# Altium schematic sheet Linelance_Schematic_page3.SchDoc
size A2; Author: Dubatouka U.V.; Address1: Address1; Address2: Address2; Address3: Address3; Address4: Address4; DocumentNumber: 3; SheetNumber: 3; SheetTotal: 3; Scale: 1:1; DocumentType: Схема электрическая принципиальная; FirstReferrence: АБВГ.123456.001
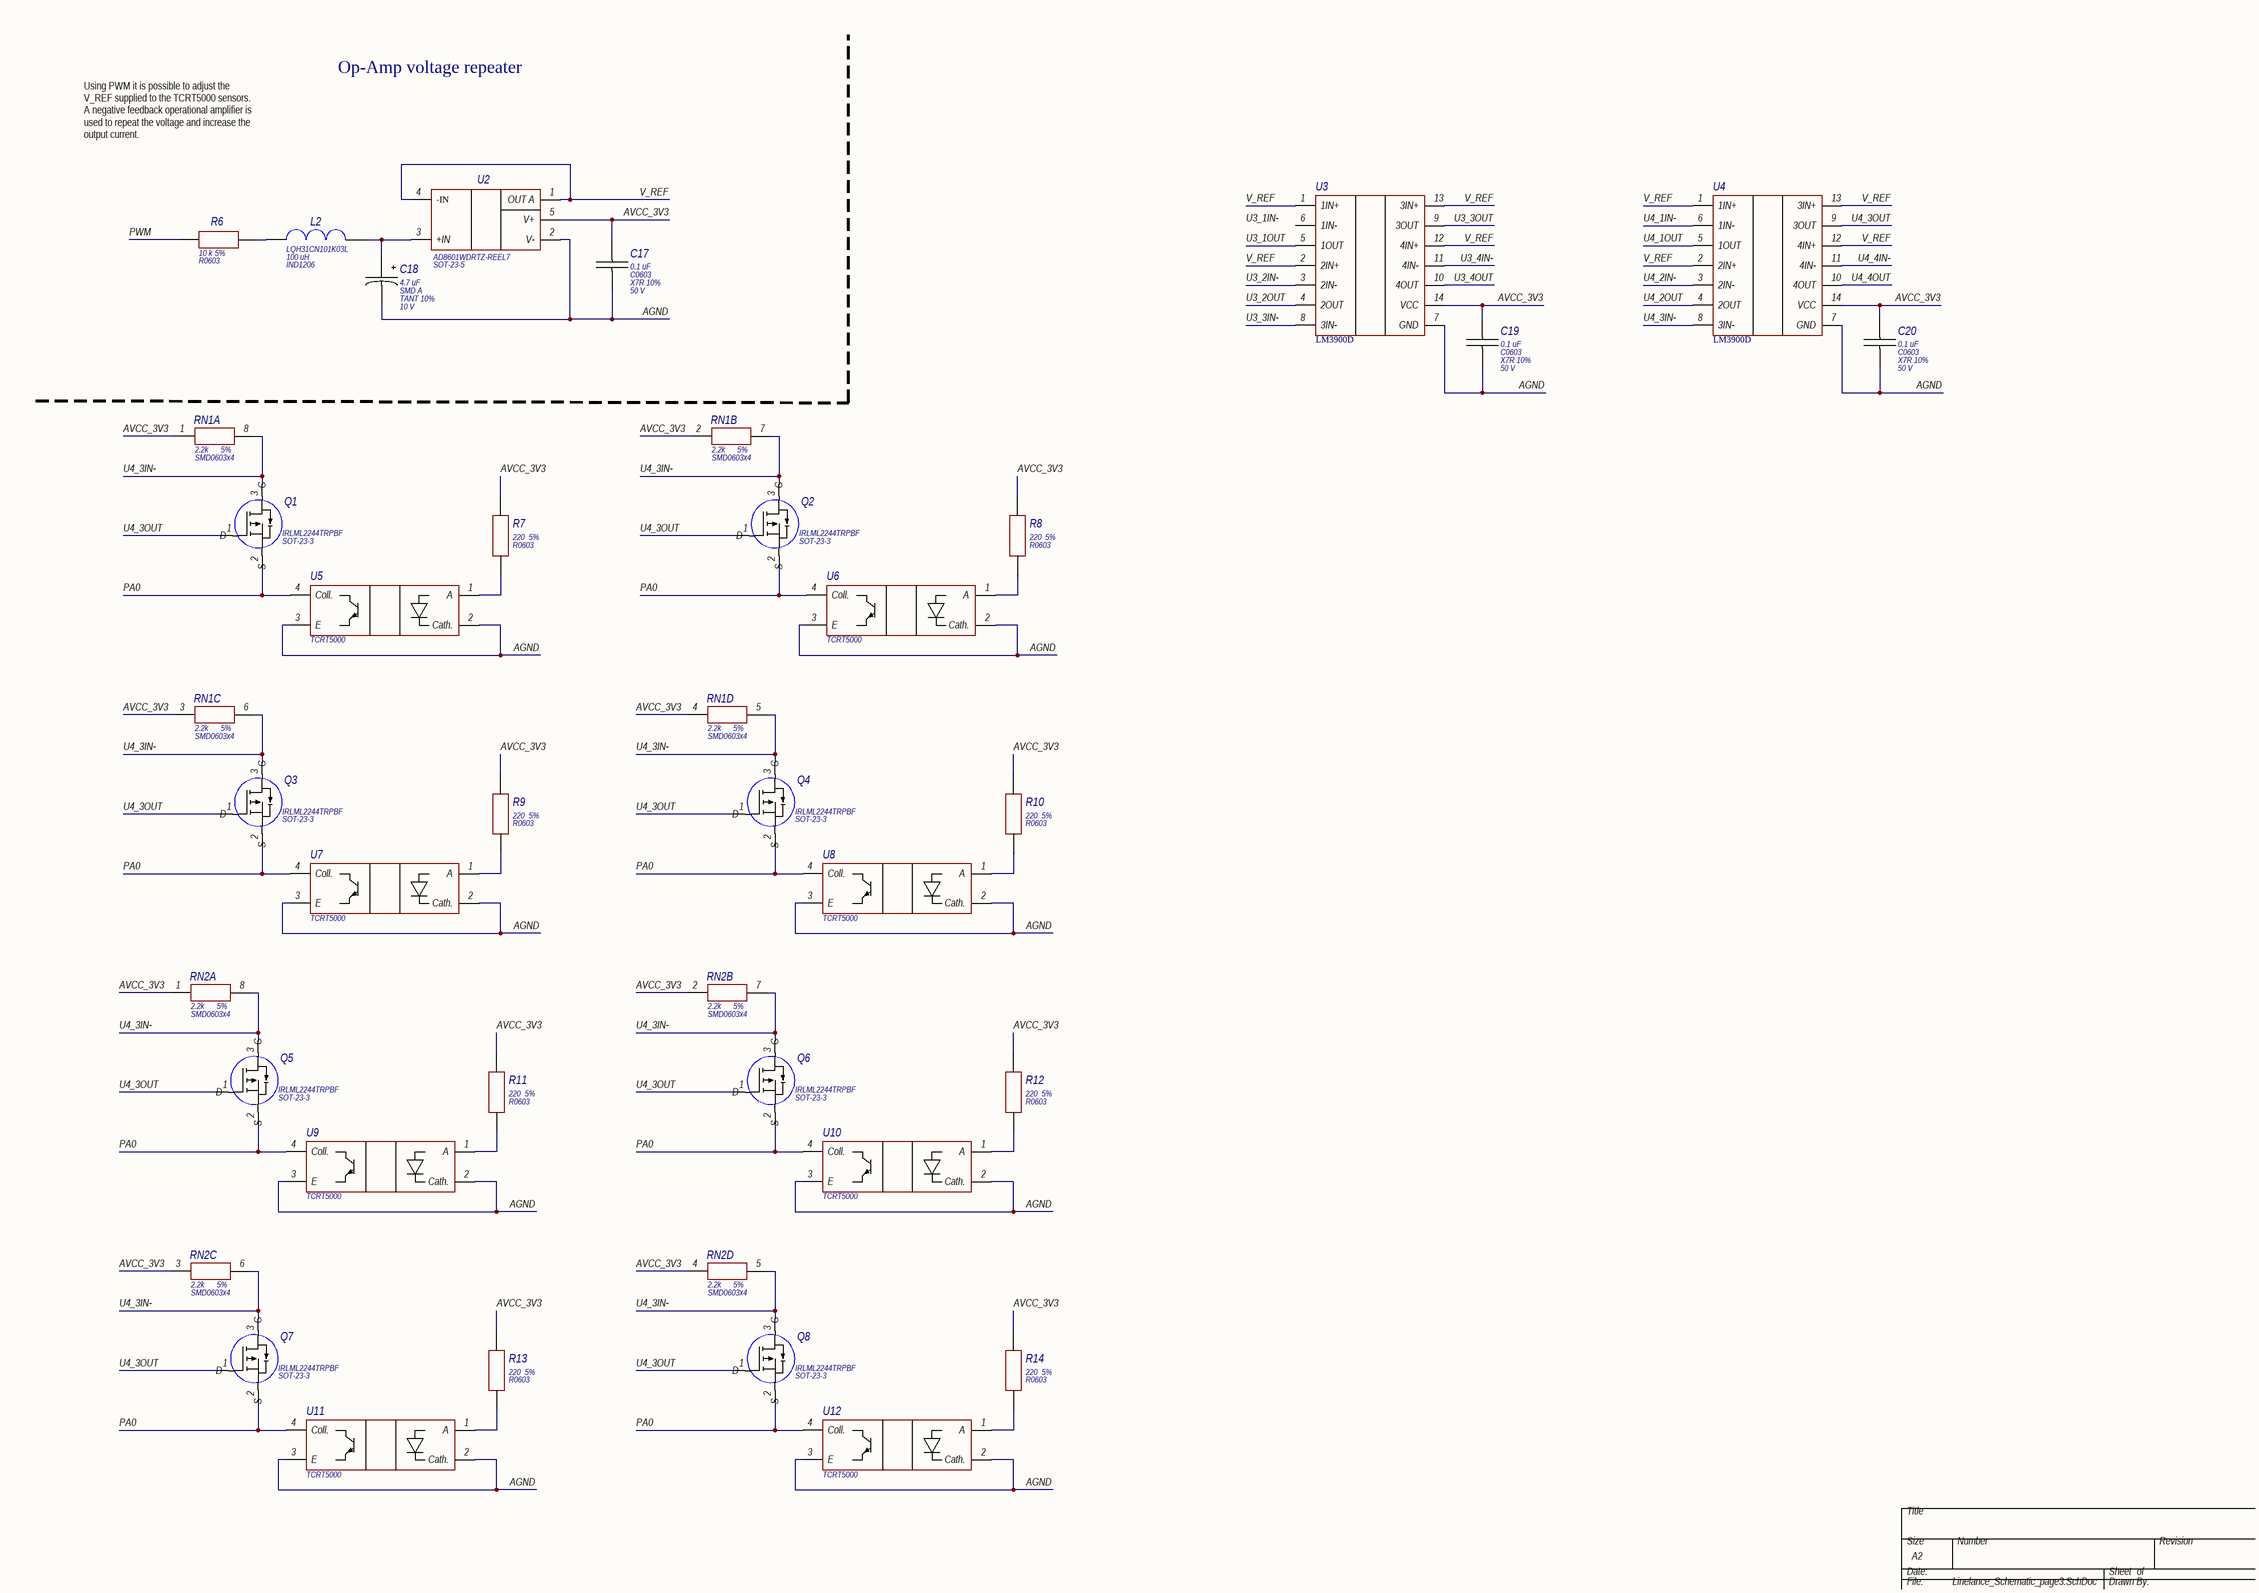
[diagram p0: Linelance_Schematic_page3.SchDoc]

## Parts
C17  Model: X7R 10%  Voltage: 50 V  [C0603]  (hidden comment: 0.1 uF)
C18  Case: SMD A  Model: TANT 10%  Voltage: 10 V  [TANT-A]  (hidden comment: 4.7 uF)
C19  Model: X7R 10%  Voltage: 50 V  [C0603]  (hidden comment: 0.1 uF)
C20  Model: X7R 10%  Voltage: 50 V  [C0603]  (hidden comment: 0.1 uF)
L2  Model: LQH31CN101K03L  [IND1206]  (hidden comment: 100 uH)
Q1  IRLML2244TRPBF  [SOT-23-3]
Q2  IRLML2244TRPBF  [SOT-23-3]
Q3  IRLML2244TRPBF  [SOT-23-3]
Q4  IRLML2244TRPBF  [SOT-23-3]
Q5  IRLML2244TRPBF  [SOT-23-3]
Q6  IRLML2244TRPBF  [SOT-23-3]
Q7  IRLML2244TRPBF  [SOT-23-3]
Q8  IRLML2244TRPBF  [SOT-23-3]
R6  value 10 k  Model: 5%  [R0603]
R7  value 220  Model: 5%  [R0603]
R8  value 220  Model: 5%  [R0603]
R9  value 220  Model: 5%  [R0603]
R10  value 220  Model: 5%  [R0603]
R11  value 220  Model: 5%  [R0603]
R12  value 220  Model: 5%  [R0603]
R13  value 220  Model: 5%  [R0603]
R14  value 220  Model: 5%  [R0603]
RN1  Model: 5%  Case: SMD0603x4  [RN_YC164-JR-072K2L]  (hidden comment: 2.2k)  (parts A,B,C,D of 4)
RN2  Model: 5%  Case: SMD0603x4  [RN_YC164-JR-072K2L]  (hidden comment: 2.2k)  (parts A,B,C,D of 4)
U2  AD8601WDRTZ-REEL7  [SOT-23-5]
U3  LM3900D  [SOIC-14]
U4  LM3900D  [SOIC-14]
U5  TCRT5000  [TCRT5000]
U6  TCRT5000  [TCRT5000]
U7  TCRT5000  [TCRT5000]
U8  TCRT5000  [TCRT5000]
U9  TCRT5000  [TCRT5000]
U10  TCRT5000  [TCRT5000]
U11  TCRT5000  [TCRT5000]
U12  TCRT5000  [TCRT5000]

## Nets
AGND: C17.2 C18.2 C19.2 C20.2 U2.2(V-) U3.7(GND) U4.7(GND) U5.2(Cath.) U5.3(E) U6.2(Cath.) U6.3(E) U7.2(Cath.) U7.3(E) U8.2(Cath.) U8.3(E) U9.2(Cath.) U9.3(E) U10.2(Cath.) U10.3(E) U11.2(Cath.) U11.3(E) U12.2(Cath.) U12.3(E)
AVCC_3V3: C17.1 C19.1 C20.1 R7.2 R8.2 R9.2 R10.2 R11.2 R12.2 R13.2 R14.2 RN1.1 RN1.2 RN1.3 RN1.4 RN2.1 RN2.2 RN2.3 RN2.4 U2.5(V+) U3.14(VCC) U4.14(VCC)
PA0: Q1.2(S) Q2.2(S) Q3.2(S) Q4.2(S) Q5.2(S) Q6.2(S) Q7.2(S) Q8.2(S) U5.4(Coll.) U6.4(Coll.) U7.4(Coll.) U8.4(Coll.) U9.4(Coll.) U10.4(Coll.) U11.4(Coll.) U12.4(Coll.)
PWM: R6.1
U3_1OUT: U3.5(1OUT)
U3_2IN-: U3.3(2IN-)
U3_2OUT: U3.4(2OUT)
U3_3IN-: U3.8(3IN-)
U3_3OUT: U3.9(3OUT)
U3_4IN-: U3.11(4IN-)
U3_4OUT: U3.10(4OUT)
U4_1IN-: U4.6(1IN-)
U4_1OUT: U4.5(1OUT)
U4_2IN-: U4.3(2IN-)
U4_2OUT: U4.4(2OUT)
U4_3IN-: Q1.3(G) Q2.3(G) Q3.3(G) Q4.3(G) Q5.3(G) Q6.3(G) Q7.3(G) Q8.3(G) RN1.5 RN1.6 RN1.7 RN1.8 RN2.5 RN2.6 RN2.7 RN2.8 U4.8(3IN-)
U4_3OUT: Q1.1(D) Q2.1(D) Q3.1(D) Q4.1(D) Q5.1(D) Q6.1(D) Q7.1(D) Q8.1(D) U4.9(3OUT)
U4_4IN-: U4.11(4IN-)
U4_4OUT: U4.10(4OUT)
V_REF: U2.1(OUT_A) U2.4(-IN) U3.1(1IN+) U3.2(2IN+) U3.12(4IN+) U3.13(3IN+) U4.1(1IN+) U4.2(2IN+) U4.12(4IN+) U4.13(3IN+)
NetC18_1: C18.1 L2.2 U2.3(+IN)
NetL2_1: L2.1 R6.2
NetR7_1: R7.1 U5.1(A)
NetR8_1: R8.1 U6.1(A)
NetR9_1: R9.1 U7.1(A)
NetR10_1: R10.1 U8.1(A)
NetR11_1: R11.1 U9.1(A)
NetR12_1: R12.1 U10.1(A)
NetR13_1: R13.1 U11.1(A)
NetR14_1: R14.1 U12.1(A)

Not connected (* = marked no-connect by the designer): U3 6(1IN-)

## Notes on the sheet
- Op-Amp voltage repeater
- Using PWM it is possible to adjust the V_REF supplied to the TCRT5000 sensors.
  A negative feedback operational amplifier is used to repeat the voltage and increase the output current.
- Labels drawn without touching a wire or pin: U3_1IN-
- Перв. примен.
- Справ. №
- Подп. и дата
- Инв. № дубл.
- Взам. инв. №
- Разраб.
- Изм.
- Лист
- № докум.
- Подп.
- Дата
- Лит.
- Масса
- Масштаб
- Пров.
- Т.контр.
- Листов
- Инв. № подл.
- Утв.
- Н.контр.
- 2.106-A3
- Копировал
- Формат А3

## Library data of the parts
C17 C19 C20 = Capasitor_ceramic: Manufacturer: Murata Manufacturing; Value: 0.1 uF; Case: C0603; HelpURL: https://www.chipdip.by/product/grm188r71h104k
C18 = Capasitor_Tantalum: Manufacturer: China; Value: 4.7 uF; HelpURL: https://www.chipdip.by/product0/6038
L2 = Inductivity: Manufacturer: Murata Manufacturing; HelpURL: https://www.chipdip.by/product/lqh31cn101k03l; Case: IND1206; Value: 100 uH
Q1-Q8 = IRLML2244TRPBF: MOSFET P-CH 20V 4.3A SOT23; Manifacturer: Infineon Technologies; Case: SOT-23-3; HelpURL: https://www.chipdip.by/product/irlml2244trpbf; Model: IRLML2244TRPBF
R6-R14 = Resistor: Rext.; Case: R0603; Manufacturer: -
  R6: HelpURL: https://www.chipdip.by/product0/65097
  R7-R14: HelpURL: https://www.chipdip.by/product0/34802
RN1 RN2 = Resistor Network: Manufacturer: Bourns; Value: 2.2k; HelpURL: https://www.chipdip.by/product/cat16-222j4
U2 = AD8601: IC OPAMP GP 1 CIRCUIT SOT23-5; Manufacturer: Analog Devices Inc.; Model: AD8601WDRTZ-REEL7; HelpURL: https://www.digikey.com/product-detail/en/analog-devices-inc/AD8601WDRTZ-REEL7/AD8601WDRTZ-REEL7TR-ND/2237618; Case: SOT-23-5
U3 U4 = LM3900: IC OPAMP GP 4 CIRCUIT 14SOIC; Manufacturer: Texas Instruments; Model: LM3900D; HelpURL: https://www.digikey.com/product-detail/en/texas-instruments/LM3900D/296-9564-5-ND/379857; Case: SOIC-14
U5-U12 = TCRT5000: SENSOR OPTO TRANS 15MM REFL PCB; Manufacturer: Vishay Semiconductor Opto Division; Model: TCRT5000; HelpURL: https://www.digikey.com/product-detail/en/vishay-semiconductor-opto-division/TCRT5000/751-1033-5-ND/1681167; Case: TCRT5000